# EAGLE design openLRSminiRX (EAGLE 7.2.0)
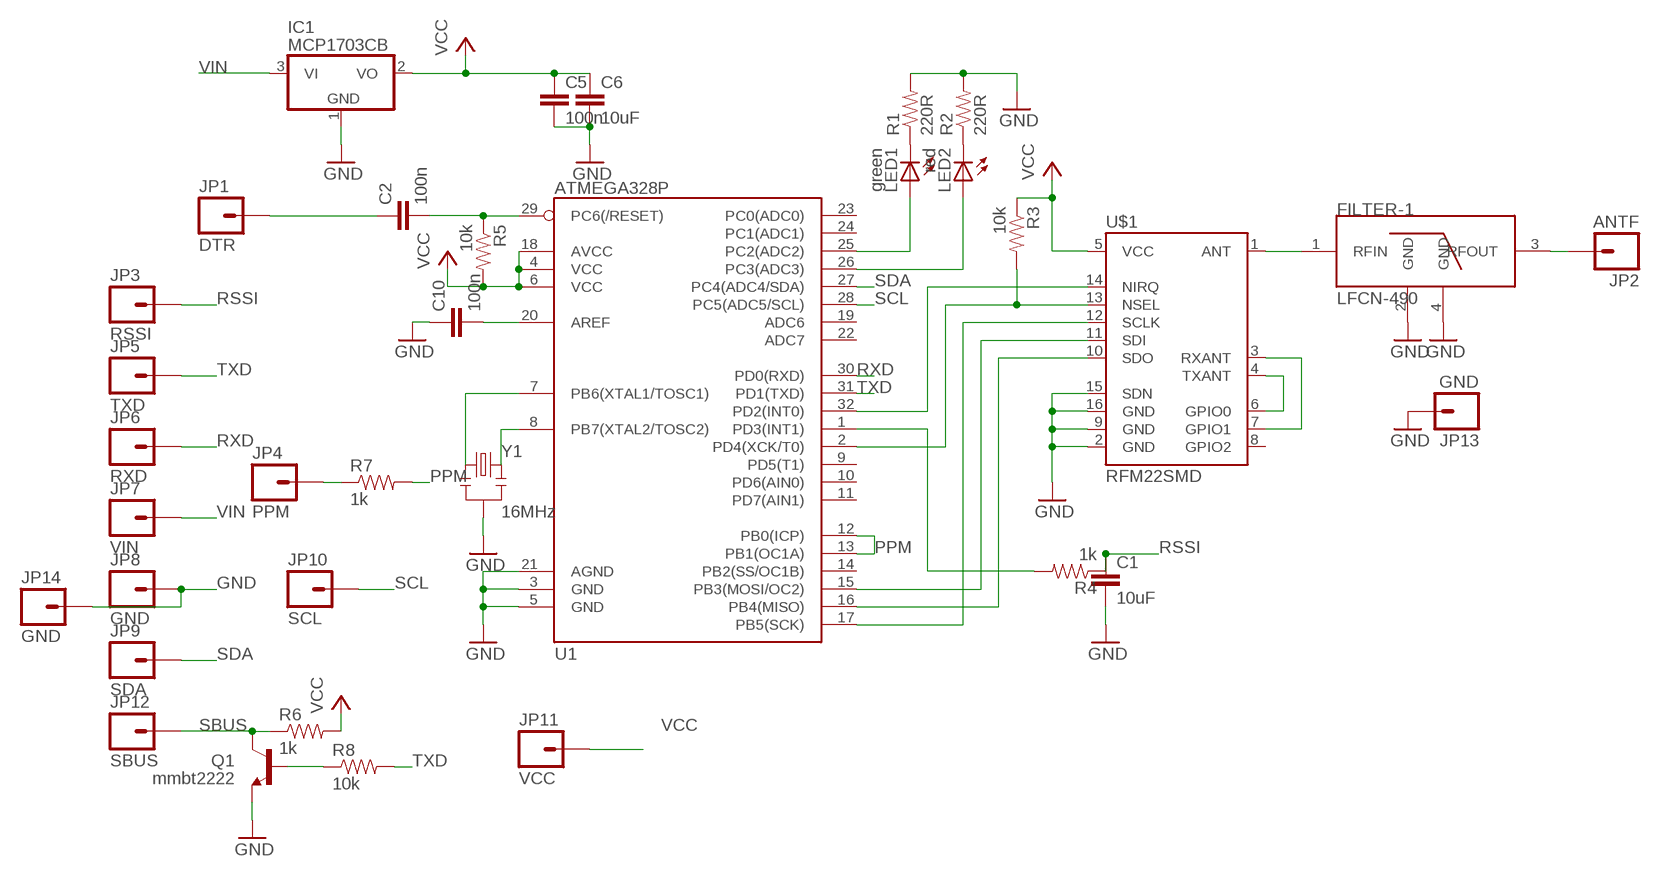
[diagram p0: schematic, sheet 1]

## Parts
C1  10uF  CAP0805  [0805]
C2  100n  CAP0805  [0805]
C5  100n  CAP0805  [0805]
C6  10uF  CAP0805  [0805]
C10  100n  CAP0805  [0805]
FILTER-1  LFCN-490  [FV1206]
IC1  MCP1703CB  [SOT23]
JP1  DTR  M01PTH  [1X01]
JP2  ANTF  M01PTH  [1X01]
JP3  RSSI  M01PTH  [1X01]
JP4  PPM  M01PTH  [1X01]
JP5  TXD  M01PTH  [1X01]
JP6  RXD  M01PTH  [1X01]
JP7  VIN  M01PTH  [1X01]
JP8  GND  M01PTH  [1X01]
JP9  SDA  M01PTH  [1X01]
JP10  SCL  M01PTH  [1X01]
JP11  VCC  M01PTH  [1X01]
JP12  SBUS  M01PTH  [1X01]
JP13  GND  M01PTH  [1X01]
JP14  GND  M01PTH  [1X01]
LED1  green  LEDSML0805  [SML0805]
LED2  red  LEDSML0805  [SML0805]
Q1  mmbt2222  TRANSISTOR_NPNSOT23  [SOT23]
R1  220R  RESISTOR0805-RES  [0805]
R2  220R  RESISTOR0805-RES  [0805]
R3  10k  RESISTOR0805-RES  [0805]
R4  1k  RESISTOR0805-RES  [0805]
R5  10k  RESISTOR0805-RES  [0805]
R6  1k  RESISTOR0805-RES  [0805]
R7  1k  RESISTOR0805-RES  [0805]
R8  10k  RESISTOR0805-RES  [0805]
U1  ATMEGA328P  ATMEGA328_SMT  [TQFP32-08]
U$1  RFM22SMD  [RFM22-XXX-S2]
Y1  16MHz  RESONATOR16MHZ  [RESONATOR-SMD]

## Nets
GND: C1.2 C5.2 C6.2 C10.1 FILTER-1.2(GND) FILTER-1.4(GND) IC1.1(GND) JP8.1 JP13.1 JP14.1 Q1.2(E) R1.2 R2.2 U1.3(GND) U1.5(GND) U1.21(AGND) U$1.2(GND) U$1.9(GND) U$1.15(SDN) U$1.16(GND) Y1.2
N$1: FILTER-1.1(RFIN) U$1.1(ANT)
N$2: U$1.4(TXANT) U$1.6(GPIO0)
N$3: U$1.3(RXANT) U$1.7(GPIO1)
N$4: FILTER-1.3(RFOUT) JP2.1
N$5: JP4.1 R7.1
N$6: R4.2 U1.1(PD3(INT1))
N$7: U1.15(PB3(MOSI/OC2)) U$1.11(SDI)
N$8: U1.16(PB4(MISO)) U$1.10(SDO)
N$9: U1.17(PB5(SCK)) U$1.12(SCLK)
N$10: R3.2 U1.2(PD4(XCK/T0)) U$1.13(NSEL)
N$11: U1.32(PD2(INT0)) U$1.14(NIRQ)
N$12: LED1.C R1.1
N$13: LED2.C R2.1
N$14: LED1.A U1.25(PC2(ADC2))
N$15: LED2.A U1.26(PC3(ADC3))
N$16: U1.7(PB6(XTAL1/TOSC1)) Y1.1
N$17: U1.8(PB7(XTAL2/TOSC2)) Y1.3
N$18: C2.2 R5.1 U1.29(PC6(/RESET))
N$19: C10.2 U1.20(AREF)
N$20: C2.1 JP1.1
N$21: Q1.1(B) R8.1
PPM: R7.2 U1.12(PB0(ICP)) U1.13(PB1(OC1A))
RSSI: C1.1 JP3.1 R4.1
RXD: JP6.1 U1.30(PD0(RXD))
SBUS: JP12.1 Q1.3(C) R6.1
SCL: JP10.1 U1.28(PC5(ADC5/SCL))
SDA: JP9.1 U1.27(PC4(ADC4/SDA))
TXD: JP5.1 R8.2 U1.31(PD1(TXD))
VCC: C5.1 C6.1 IC1.2(VO) JP11.1 R3.1 R5.2 R6.2 U1.4(VCC) U1.6(VCC) U1.18(AVCC) U$1.5(VCC)
VIN: IC1.3(VI) JP7.1
Unconnected: U1.9(PD5(T1)) U1.10(PD6(AIN0)) U1.11(PD7(AIN1)) U1.14(PB2(SS/OC1B)) U1.19(ADC6) U1.22(ADC7) U1.23(PC0(ADC0)) U1.24(PC1(ADC1)) U$1.8(GPIO2)

## Library data of the parts
C1 C2 C5 C6 C10 = SparkFun-Capacitors:CAP: Capacitor Standard 0603 ceramic capacitor, and 0.1" leaded capacitor.
FILTER-1 = minicircuits:LFCN: Low pass Filter Features: Excellent power handling: 8/9 W (depending on reference) Max DC current 0.5A/1A (depending on reference) Small size 5/7 sections (depending on reference) Operating temperature: -55°C - 100°C Applications: Harmonic rejection VHF/UHF transmitters/receivers Lab use
IC1 = linear:MCP1703: 250 mA, 16V, Low Quiescent Current LDO Regulator Source: http://ww1.microchip.com/downloads/en/DeviceDoc/22049b.pdf
JP1-JP14 = SparkFun-Connectors:M01: Header 1 Standard 1-pin 0.1" header. Use with straight break away headers (SKU : PRT-00116), right angle break away headers (PRT-00553), swiss pins (PRT-00743), machine pins (PRT-00117), and female headers (PRT-00115).
LED1 LED2 = led:LED: LED OSRAM: - CHIPLED LG R971, LG N971, LY N971, LG Q971, LY Q971, LO R971, LY R971 LH N974, LH R974 LS Q976, LO Q976, LY Q976 LO Q996 - Hyper CHIPLED LW Q18S LB Q993, LB Q99A, LB R99A - SideLED LS A670, LO A670, LY A670, LG A670, LP A670 LB A673, LV A673, LT A673, LW A673 LH A674 LY A675 LS A676, LA A676, LO A676, LY A676, LW A676 LS A679, LY A679, LG A679 - Hyper Micro SIDELED® LS Y876, LA Y876, LO Y876, LY Y876 LT Y87S - SmartLED LW L88C, LW L88S LB L89C, LB L89S, LG L890 LS L89K, LO L89K, LY L89K LS L896, LA L896, LO L896, LY L896 - TOPLED LS T670, LO T670, LY T670, LG T670, LP T670 LSG T670, LSP T670, LSY T670, LOP T670, LYG T670 LG T671, LOG T671, LSG T671 LB T673, LV T673, LT T673, LW T673 LH T674 LS T676, LA T676, LO T676, LY T676, LB T676, LH T676, LSB T676, LW T676 LB T67C, LV T67C, LT T67C, LS T67K, LO T67K, LY T67K, LW E67C LS E67B, LA E67B, LO E67B, LY E67B, LB E67C, LV E67C, LT E67C LW T67C LS T679, LY T679, LG T679 LS T770, LO T770, LY T770, LG T770, LP T770 LB T773, LV T773, LT T773, LW T773 LH T774 LS E675, LA E675, LY E675, LS T675 LS T776, LA T776, LO T776, LY T776, LB T776 LHGB T686 LT T68C, LB T68C - Hyper Mini TOPLED® LB M676 - Mini TOPLED Santana® LG M470 LS M47K, LO M47K, LY M47K Source: http://www.osram.convergy.de LUXEON: - LUMILED® LXK2-PW12-R00, LXK2-PW12-S00, LXK2-PW14-U00, LXK2-PW14-V00 LXK2-PM12-R00, LXK2-PM12-S00, LXK2-PM14-U00 LXK2-PE12-Q00, LXK2-PE12-R00, LXK2-PE12-S00, LXK2-PE14-T00, LXK2-PE14-U00 LXK2-PB12-K00, LXK2-PB12-L00, LXK2-PB12-M00, LXK2-PB14-N00, LXK2-PB14-P00, LXK2-PB14-Q00 LXK2-PR12-L00, LXK2-PR12-M00, LXK2-PR14-Q00, LXK2-PR14-R00 LXK2-PD12-Q00, LXK2-PD12-R00, LXK2-PD12-S00 LXK2-PH12-R00, LXK2-PH12-S00 LXK2-PL12-P00, LXK2-PL12-Q00, LXK2-PL12-R00 Source: www.luxeon.com KINGBRIGHT: KA-3528ASYC Source: www.kingbright.com
Q1 = SparkFun-DiscreteSemi:TRANSISTOR_NPN: Generic NPN BJT. MMBT2222 is the common NPN we use. Double check against datasheet- not all devices are the same!
R1-R8 = SparkFun-Resistors:RESISTOR: Resistor Basic schematic elements and footprints for 0603, 1206, and PTH resistors.
U1 = SparkFun-DigitalIC:ATMEGA328_SMT: 32-Pin Atmega328 part Commonly used on Arduino compatible boards Available in QFP and QFN packages TQFP is IC-09069 QFN is non-stock; PROD_ID: IC-09069
U$1 = SparkFun-RF:RFM22: The RFM22 is a low-power, low cost radio that is capable of operating in the 434MHz and 900MHz open bands. It's frequency is software defined and there are some very good libraries written for it.
Y1 = SparkFun-FreqCtrl:RESONATOR: Resonator Small SMD resonator. Used, eg, on the Arduino Pro/ Pro Mini boards. 8MHz- XTAL-08895 16MHz- XTAL-08900; PROD_ID: XTAL-08900

## Board
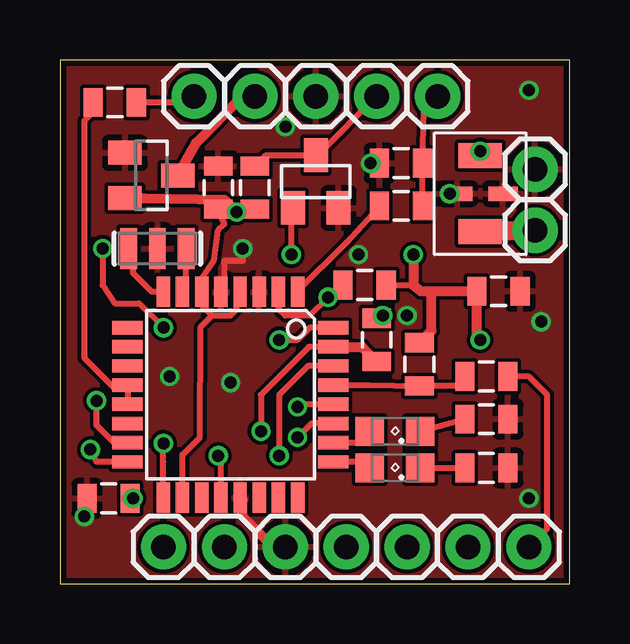
[diagram p1: board, top side]
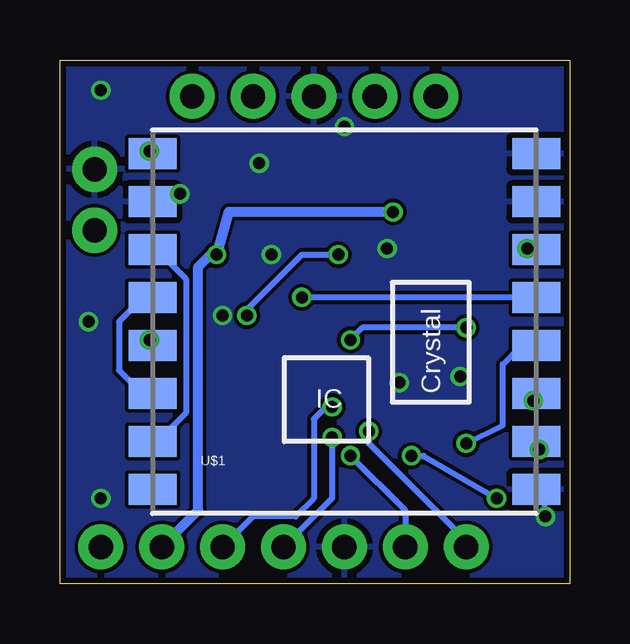
[diagram p2: board, bottom side, seen from below]

Size 21.26 x 21.83 mm. Coordinates in mm from the lower left corner, seen from the top.
Outline: 0,0 21.26,0 21.26,21.83 0,21.83 0,0
Copper layers (1*16): Top 0.035mm / dielectric 1.5mm / Bottom 0.035mm
Design rules "ITEADstudio_DRC": minimum track width 6mil, minimum drill 12mil, track to track 6mil, track to pad 6mil, pad to pad 6mil, via to via 6mil, smd to smd 0mil, copper to edge 10mil, drill to drill 10mil, minimum pad ring 10mil, minimum via ring 6mil, stop-mask expansion 2mil, vias tented up to drill 100mil, thermal gap 10mil

### Footprints (pad centres in the part's own frame; a part is rotated, then mirrored left to right if it is on the bottom)
0805 = smd 0.8 x 1.2: 1 -0.9,0; 2 0.9,0
FV1206 = smd 1.041 x 1.803: 1 -1.587,0; 3 1.587,0 | smd 0.61 x 1.245: 2 0,-0.953; 4 0,0.953
SOT23 = smd 1 x 1.4: 1 -0.95,-1.1; 2 0.95,-1.1; 3 0,1.1
1X01 = drill 1.016 pad 1.88: 1 0,0
SML0805 = smd 1.2 x 1.2: A 1.05,0; C -1.05,0
TQFP32-08 = smd 1.27 x 0.559: 1 -4.293,2.8; 2 -4.293,2; 3 -4.293,1.2; 4 -4.293,0.4; 5 -4.293,-0.4; 6 -4.293,-1.2; 7 -4.293,-2; 8 -4.293,-2.8; 17 4.293,-2.8; 18 4.293,-2; 19 4.293,-1.2; 20 4.293,-0.4; 21 4.293,0.4; 22 4.293,1.2; 23 4.293,2; 24 4.293,2.8 | smd 0.559 x 1.27: 9 -2.8,-4.293; 10 -2,-4.293; 11 -1.2,-4.293; 12 -0.4,-4.293; 13 0.4,-4.293; 14 1.2,-4.293; 15 2,-4.293; 16 2.8,-4.293; 25 2.8,4.293; 26 2,4.293; 27 1.2,4.293; 28 0.4,4.293; 29 -0.4,4.293; 30 -1.2,4.293; 31 -2,4.293; 32 -2.8,4.293
RFM22-XXX-S2 = smd 2 x 1.3: 1 -8,7; 2 -8,5; 3 -8,3; 4 -8,1; 5 -8,-1; 6 -8,-3; 7 -8,-5; 8 -8,-7; 9 8,-7; 10 8,-5; 11 8,-3; 12 8,-1; 13 8,1; 14 8,3; 15 8,5; 16 8,7
RESONATOR-SMD = smd 0.7 x 1.7: 1 -1.2,0; 2 0,0; 3 1.2,0

### Placement (x,y rotation side)
C1  14.22,17.53 180 top
C2  17.78,8.64 180 top
C5  18.29,12.19 0 top
C6  6.6,16.51 90 top
C10  2.03,3.56 0 top
FILTER-1  17.53,16.26 270 top
IC1  3.81,17.02 270 top
JP1  19.56,1.52 0 top
JP2  19.81,14.73 0 top
JP3  15.75,20.32 0 top
JP4  5.59,20.32 0 top
JP5  4.32,1.52 0 top
JP6  6.86,1.52 0 top
JP7  8.13,20.32 0 top
JP8  19.81,17.27 0 top
JP9  11.94,1.52 0 top
JP10  14.48,1.52 0 top
JP11  17.02,1.52 0 top
JP12  13.21,20.32 0 top
JP13  9.4,1.52 0 top
JP14  10.67,20.32 0 top
LED1  13.97,4.83 180 top
LED2  13.97,6.35 180 top
Q1  10.67,16.76 0 top
R1  17.78,4.83 0 top
R2  17.78,6.86 0 top
R3  12.7,12.45 180 top
R4  14.22,15.75 180 top
R5  14.99,9.14 90 top
R6  8.13,16.51 270 top
R7  2.29,20.07 180 top
R8  13.21,10.16 270 top
U1  7.11,7.87 270 top
U$1  9.4,10.92 0 bottom
Y1  4.06,13.97 180 top

### Tracks (layer width: path | path; a pad name or v marks a point on that pad's centre or on a via)
GND  (via drill 0.5)
  Top 0.254: C10.1 1.08,3.49 v1.02,2.79 | U1.5 6.86,12.17 6.86,13.46 7.62,13.46 v7.62,13.97
  Top 0.406: JP13.1 8.89,1.52 7.62,2.79 7.62,3.47 U1.21
  Bottom 0.254: v1.02,2.79 1.03,3.56 U$1.9
  other vias: 19.56,3.56 14.48,11.18 9.4,19.05 12.95,17.53 16.26,16.26 7.11,8.38 12.45,13.72 20.07,10.92 19.56,20.57 4.57,8.64
  pour Bottom: 0.25,-0.51 21.59,0 21.59,22.1 21.08,22.35 0,22.1 -0.25,21.59 -0.25,0
  pour Top: 21.59,-0.25 21.59,21.84 21.34,22.35 -0.51,22.1 -0.25,-0.25
N$1  (via drill 0.5 pad 0.25)
  Top 0.406: v17.53,18.03 FILTER-1.1
  Bottom 0.406: U$1.1 v17.53,18.03
N$2
  Bottom 0.254: U$1.4 17.8,11.92 18.8,10.92 18.8,8.89 18.29,8.38 17.86,8.38 U$1.6
N$3
  Bottom 0.254: U$1.3 17.22,13.92 16,12.7 16,7.11 16.76,6.35 16.97,6.35 U$1.7
N$4
  Top 0.813: FILTER-1.3 JP2.1
N$5
  Top 0.254: R7.1 5.33,20.07 JP4.1
N$6
  Top 0.254: U1.1 9.91,12.2 11.94,14.22 13.46,15.89 R4.2
N$7  (via drill 0.5)
  Top 0.254: U1.15 2.25,5.87 1.52,6.6 v1.52,7.62
  Bottom 0.254: v1.52,7.62 1.1,7.62 U$1.11
N$8  (via drill 0.5)
  Top 0.254: U1.16 1.53,5.07 v1.27,5.59
  Bottom 0.254: v1.27,5.59 1.06,5.59 U$1.10
N$9  (via drill 0.5)
  Top 0.254: U1.17 4.31,5.07 v4.32,5.84
  Bottom 0.254: v4.32,5.84 2.79,6.6 2.79,9.14 2.03,9.91 1.41,9.91 U$1.12
N$10  (via drill 0.5)
  Top 0.254: v11.18,11.94 11.68,12.45 R3.2 11.24,11.94 v11.18,11.94 | v11.18,11.94 10.41,11.18 9.4,11.18 9.14,11.43 9.14,12.13 U1.2
  Bottom 0.254: U$1.13 11.16,11.92 v11.18,11.94
N$11  (via drill 0.5)
  Top 0.254: U1.32 10.42,10.67 9.91,10.16 v9.14,10.16 | v1.78,13.97 1.78,12.45 2.29,11.68 3.3,11.68 v4.32,10.67
  Bottom 0.254: v4.32,10.67 8.64,10.67 v9.14,10.16 | v1.78,13.97 1.45,13.97 U$1.14
N$12
  Top 0.254: LED1.C R1.1
N$13
  Top 0.254: LED2.C R2.1
N$14
  Top 0.254: LED1.A 12.67,5.07 U1.25
N$15
  Top 0.254: LED2.A 12.44,5.87 U1.26
N$16
  Top 0.254: U1.7 5.26,12.17 Y1.1
N$17
  Top 0.254: U1.8 3.83,12.17 3.05,12.95 3.05,13.79 Y1.3
N$18
  Top 0.254: U1.29 12.87,8.27 R5.1 16.49,8.24 C2.2
N$19  (via drill 0.5)
  Top 0.254: U1.20 6.71,5.23 v6.6,5.33 | v3.05,3.56 C10.2
  Bottom 0.254: v6.6,5.33 6.1,5.33 v3.05,3.56
N$20
  Top 0.254: JP1.1 20.32,2.29 20.32,7.87 19.56,8.64 C2.1
N$21  (via drill 0.5)
  Top 0.254: R8.1 13.35,11.06 v13.46,11.18 | v9.65,13.72 9.65,15.6 Q1.1
  Bottom 0.254: v13.46,11.18 13.46,11.43 11.18,13.72 v9.65,13.72
PPM
  Top 0.254: R7.2 1.39,19.67 1.02,19.3 1.02,9.4 2.29,8.13 2.67,8.13 U1.12 U1.13
RSSI
  Top 0.254: R4.1 C1.1 15.17,19.75 JP3.1
RXD  (via drill 0.5)
  Top 0.254: U1.30 10.34,9.07 9.14,7.87 v9.14,5.33
  Bottom 0.254: v9.14,5.33 6.86,3.05 JP6.1
SBUS
  Top 0.254: R6.1 8.58,17.86 Q1.3 10.75,17.86 JP12.1
SCL  (via drill 0.5)
  Top 0.254: U1.28 10.01,7.47 v9.91,7.37
  Bottom 0.254: v9.91,7.37 10.16,7.37 10.67,6.86 10.67,3.56 11.43,2.79 13.21,2.79 JP10.1
SDA  (via drill 0.5)
  Top 0.254: U1.27 10.48,6.67 v9.91,6.1
  Bottom 0.254: v9.91,6.1 9.91,3.56 JP9.1
TXD  (via drill 0.5)
  Top 0.254: U1.31 10.38,9.87 8.38,7.87 v8.38,6.35
  Top 0.406: U1.31 12.59,9.87 R8.2
  Bottom 0.254: v8.38,6.35 8.38,5.84 4.57,2.03 4.57,1.78 JP5.1
VCC  (via drill 0.5)
  Top 0.254: 6.35,11.18 5.91,11.61 U1.6 5.91,12.7 6.42,13.46 6.6,14.73 6.86,14.99 C6.1 7.43,15.43 v7.37,15.49 | 6.35,11.18 7.11,11.18 7.37,11.43 7.37,12.02 U1.4 | U1.18 5.11,5.37 5.84,6.1 5.87,10.7 6.35,11.18 | R3.1 14.73,12.45
  Top 0.406: v14.73,13.72 14.73,12.45 15.05,12.19 15.49,12.19 | 15.49,12.19 C5.1 17.39,10.3 v17.53,10.16 | IC1.2 3.49,16.07 6.86,16 v7.37,15.49 8.01,15.49 R6.2 | R5.2 15.49,10.55 15.49,12.19
  Bottom 0.406: v7.37,15.49 14.22,15.49 v14.73,13.72 14.99,13.72 15.49,13.21 15.49,3.05 JP11.1 | 17.78,9.91 17.76,9.92 U$1.5 17.53,10.05 v17.53,10.16
VIN
  Top 0.406: IC1.3 5.67,18.37 7.62,20.32 JP7.1